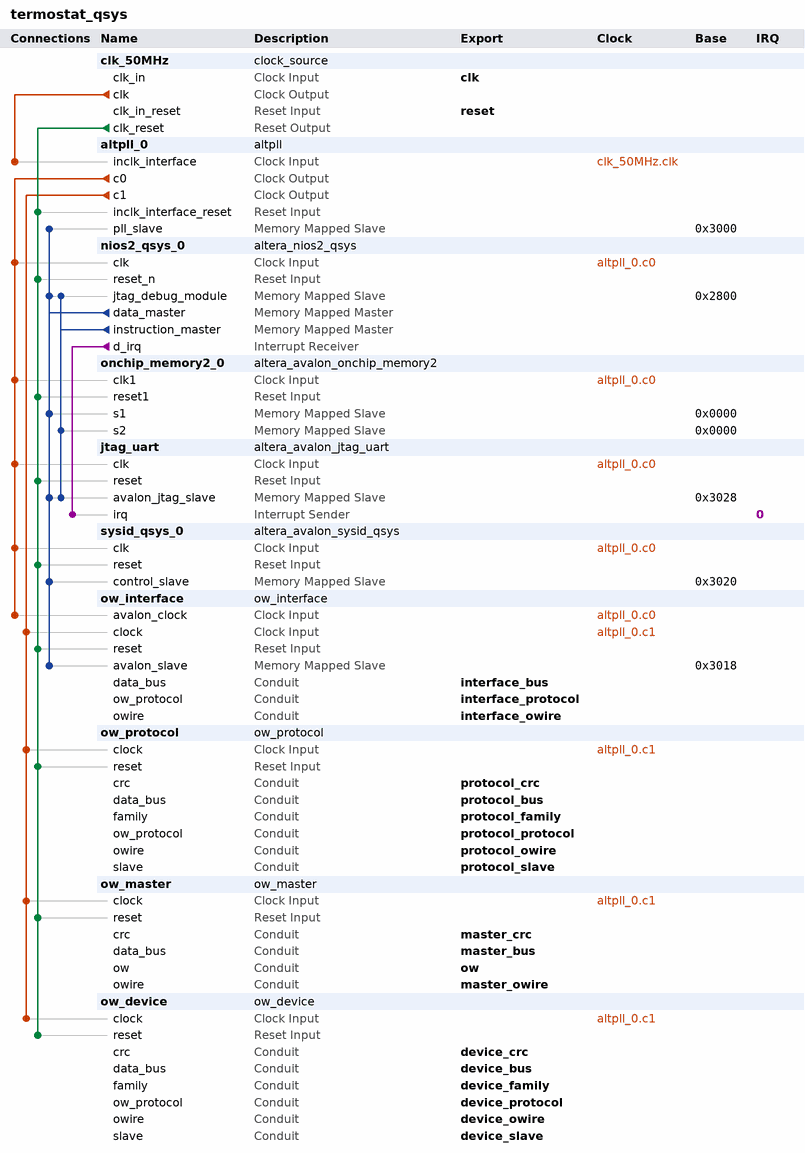
[diagram p0: system contents]
# Platform Designer (Qsys) system termostat_qsys, Cyclone IV E EP4CE6E22C8
# Parameters at their usual value, and those the tool derives, are not listed.
package require -exact qsys 14.0
create_system termostat_qsys
set_project_property DEVICE_FAMILY {Cyclone IV E}
set_project_property DEVICE EP4CE6E22C8

add_instance clk_50MHz clock_source 14.0
set_instance_parameter_value clk_50MHz clockFrequency 50000000

add_instance altpll_0 altpll 14.0
set_instance_parameter_value altpll_0 INCLK0_INPUT_FREQUENCY 20000
set_instance_parameter_value altpll_0 CLK0_MULTIPLY_BY 2
set_instance_parameter_value altpll_0 CLK1_MULTIPLY_BY 1
set_instance_parameter_value altpll_0 CLK0_DIVIDE_BY 1
set_instance_parameter_value altpll_0 CLK1_DIVIDE_BY 50
set_instance_parameter_value altpll_0 CLK1_PHASE_SHIFT 0
set_instance_parameter_value altpll_0 CLK1_DUTY_CYCLE 50
set_instance_parameter_value altpll_0 PORT_clk1 PORT_USED
set_instance_parameter_value altpll_0 PORT_clk2 PORT_UNUSED
set_instance_parameter_value altpll_0 PORT_clk3 PORT_UNUSED
set_instance_parameter_value altpll_0 PORT_ARESET PORT_UNUSED
set_instance_parameter_value altpll_0 PORT_LOCKED PORT_UNUSED

add_instance nios2_qsys_0 altera_nios2_qsys 14.0
set_instance_parameter_value nios2_qsys_0 resetrequest_enabled true
set_instance_parameter_value nios2_qsys_0 resetSlave onchip_memory2_0.s2
set_instance_parameter_value nios2_qsys_0 mmu_TLBMissExcSlave None
set_instance_parameter_value nios2_qsys_0 exceptionSlave onchip_memory2_0.s2
set_instance_parameter_value nios2_qsys_0 breakSlave nios2_qsys_0.jtag_debug_module
set_instance_parameter_value nios2_qsys_0 impl Tiny
set_instance_parameter_value nios2_qsys_0 icache_size 4096

add_instance onchip_memory2_0 altera_avalon_onchip_memory2 14.0
set_instance_parameter_value onchip_memory2_0 dataWidth 32
set_instance_parameter_value onchip_memory2_0 dualPort true
set_instance_parameter_value onchip_memory2_0 initMemContent true
set_instance_parameter_value onchip_memory2_0 initializationFileName onchip_mem.hex
set_instance_parameter_value onchip_memory2_0 memorySize 8192
set_instance_parameter_value onchip_memory2_0 readDuringWriteMode OLD_DATA
set_instance_parameter_value onchip_memory2_0 singleClockOperation true

add_instance jtag_uart altera_avalon_jtag_uart 14.0
set_instance_parameter_value jtag_uart simInteractiveOptions NO_INTERACTIVE_WINDOWS

add_instance sysid_qsys_0 altera_avalon_sysid_qsys 14.0
set_instance_parameter_value sysid_qsys_0 id 1

add_instance ow_interface ow_interface 1.0

add_instance ow_protocol ow_protocol 1.0

add_instance ow_master ow_master 1.0
set_instance_parameter_value ow_master OVERDRIVE 0
set_instance_parameter_value ow_master MULTIPLIER 1

add_instance ow_device ow_device 1.0

# connections
add_connection altpll_0.c0 jtag_uart.clk clock
add_connection altpll_0.c0 nios2_qsys_0.clk clock
add_connection altpll_0.c0 onchip_memory2_0.clk1 clock
add_connection altpll_0.c0 ow_interface.avalon_clock clock
add_connection altpll_0.c0 sysid_qsys_0.clk clock
add_connection altpll_0.c1 ow_device.clock clock
add_connection altpll_0.c1 ow_interface.clock clock
add_connection altpll_0.c1 ow_master.clock clock
add_connection altpll_0.c1 ow_protocol.clock clock
add_connection clk_50MHz.clk altpll_0.inclk_interface clock
add_connection clk_50MHz.clk_reset altpll_0.inclk_interface_reset reset
add_connection clk_50MHz.clk_reset jtag_uart.reset reset
add_connection clk_50MHz.clk_reset nios2_qsys_0.reset_n reset
add_connection clk_50MHz.clk_reset onchip_memory2_0.reset1 reset
add_connection clk_50MHz.clk_reset ow_device.reset reset
add_connection clk_50MHz.clk_reset ow_interface.reset reset
add_connection clk_50MHz.clk_reset ow_master.reset reset
add_connection clk_50MHz.clk_reset ow_protocol.reset reset
add_connection clk_50MHz.clk_reset sysid_qsys_0.reset reset
add_connection nios2_qsys_0.data_master altpll_0.pll_slave avalon
set_connection_parameter_value nios2_qsys_0.data_master/altpll_0.pll_slave baseAddress 0x3000
add_connection nios2_qsys_0.data_master jtag_uart.avalon_jtag_slave avalon
set_connection_parameter_value nios2_qsys_0.data_master/jtag_uart.avalon_jtag_slave baseAddress 0x3028
add_connection nios2_qsys_0.data_master nios2_qsys_0.jtag_debug_module avalon
set_connection_parameter_value nios2_qsys_0.data_master/nios2_qsys_0.jtag_debug_module baseAddress 0x2800
add_connection nios2_qsys_0.data_master onchip_memory2_0.s1 avalon
set_connection_parameter_value nios2_qsys_0.data_master/onchip_memory2_0.s1 baseAddress 0x0000
add_connection nios2_qsys_0.data_master ow_interface.avalon_slave avalon
set_connection_parameter_value nios2_qsys_0.data_master/ow_interface.avalon_slave baseAddress 0x3018
add_connection nios2_qsys_0.data_master sysid_qsys_0.control_slave avalon
set_connection_parameter_value nios2_qsys_0.data_master/sysid_qsys_0.control_slave baseAddress 0x3020
add_connection nios2_qsys_0.instruction_master jtag_uart.avalon_jtag_slave avalon
set_connection_parameter_value nios2_qsys_0.instruction_master/jtag_uart.avalon_jtag_slave baseAddress 0x3028
add_connection nios2_qsys_0.instruction_master nios2_qsys_0.jtag_debug_module avalon
set_connection_parameter_value nios2_qsys_0.instruction_master/nios2_qsys_0.jtag_debug_module baseAddress 0x2800
add_connection nios2_qsys_0.instruction_master onchip_memory2_0.s2 avalon
set_connection_parameter_value nios2_qsys_0.instruction_master/onchip_memory2_0.s2 baseAddress 0x0000
add_connection nios2_qsys_0.d_irq jtag_uart.irq interrupt
set_connection_parameter_value nios2_qsys_0.d_irq/jtag_uart.irq irqNumber 0

# exported interfaces
add_interface clk clock sink
set_interface_property clk EXPORT_OF clk_50MHz.clk_in
add_interface reset reset sink
set_interface_property reset EXPORT_OF clk_50MHz.clk_in_reset
add_interface interface_bus conduit end
set_interface_property interface_bus EXPORT_OF ow_interface.data_bus
add_interface protocol_bus conduit end
set_interface_property protocol_bus EXPORT_OF ow_protocol.data_bus
add_interface protocol_owire conduit end
set_interface_property protocol_owire EXPORT_OF ow_protocol.owire
add_interface ow conduit end
set_interface_property ow EXPORT_OF ow_master.ow
add_interface master_owire conduit end
set_interface_property master_owire EXPORT_OF ow_master.owire
add_interface master_bus conduit end
set_interface_property master_bus EXPORT_OF ow_master.data_bus
add_interface protocol_slave conduit end
set_interface_property protocol_slave EXPORT_OF ow_protocol.slave
add_interface interface_owire conduit end
set_interface_property interface_owire EXPORT_OF ow_interface.owire
add_interface interface_protocol conduit end
set_interface_property interface_protocol EXPORT_OF ow_interface.ow_protocol
add_interface protocol_protocol conduit end
set_interface_property protocol_protocol EXPORT_OF ow_protocol.ow_protocol
add_interface master_crc conduit end
set_interface_property master_crc EXPORT_OF ow_master.crc
add_interface protocol_crc conduit end
set_interface_property protocol_crc EXPORT_OF ow_protocol.crc
add_interface device_crc conduit end
set_interface_property device_crc EXPORT_OF ow_device.crc
add_interface device_slave conduit end
set_interface_property device_slave EXPORT_OF ow_device.slave
add_interface device_family conduit end
set_interface_property device_family EXPORT_OF ow_device.family
add_interface device_protocol conduit end
set_interface_property device_protocol EXPORT_OF ow_device.ow_protocol
add_interface device_owire conduit end
set_interface_property device_owire EXPORT_OF ow_device.owire
add_interface device_bus conduit end
set_interface_property device_bus EXPORT_OF ow_device.data_bus
add_interface protocol_family conduit end
set_interface_property protocol_family EXPORT_OF ow_protocol.family

set_interconnect_requirement {$system} qsys_mm.clockCrossingAdapter HANDSHAKE
set_interconnect_requirement {$system} qsys_mm.maxAdditionalLatency 1
set_interconnect_requirement {$system} qsys_mm.insertDefaultSlave false

save_system termostat_qsys.qsys
